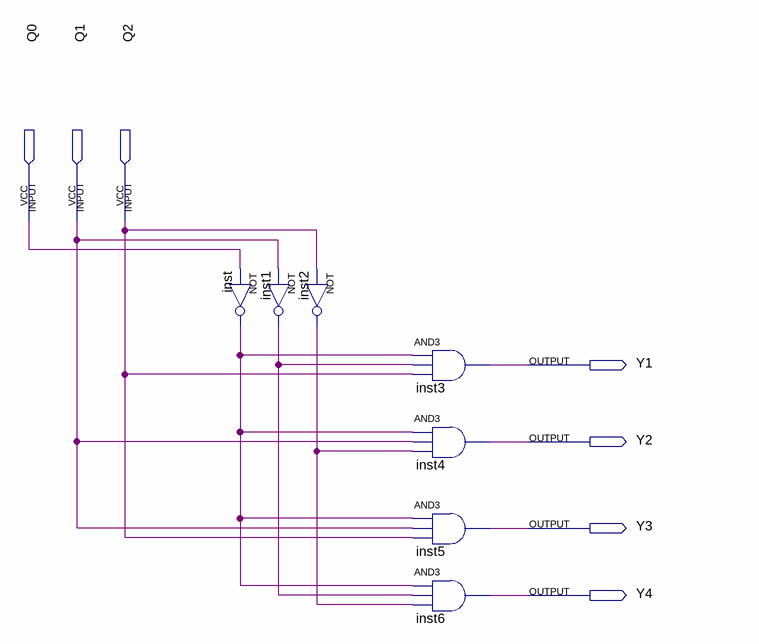
[diagram p0: schematic sheet]
// Quartus schematic M_Q_to_Y.bdf as structural Verilog: 7 symbols, 7 pins
module M_Q_to_Y (
  input  Q0,
  input  Q1,
  input  Q2,
  output Y1,
  output Y2,
  output Y3,
  output Y4
);

  wire inst1_out, inst2_out, inst_out;

  not inst (inst_out, Q0);
  not inst1 (inst1_out, Q1);
  not inst2 (inst2_out, Q2);
  and inst3 (Y1, inst_out, inst1_out, Q2);
  and inst4 (Y2, inst_out, Q1, inst2_out);
  and inst5 (Y3, inst_out, Q1, Q2);
  and inst6 (Y4, inst_out, inst1_out, inst2_out);
endmodule
